# EAGLE design slider4 (EAGLE 6.5.0)
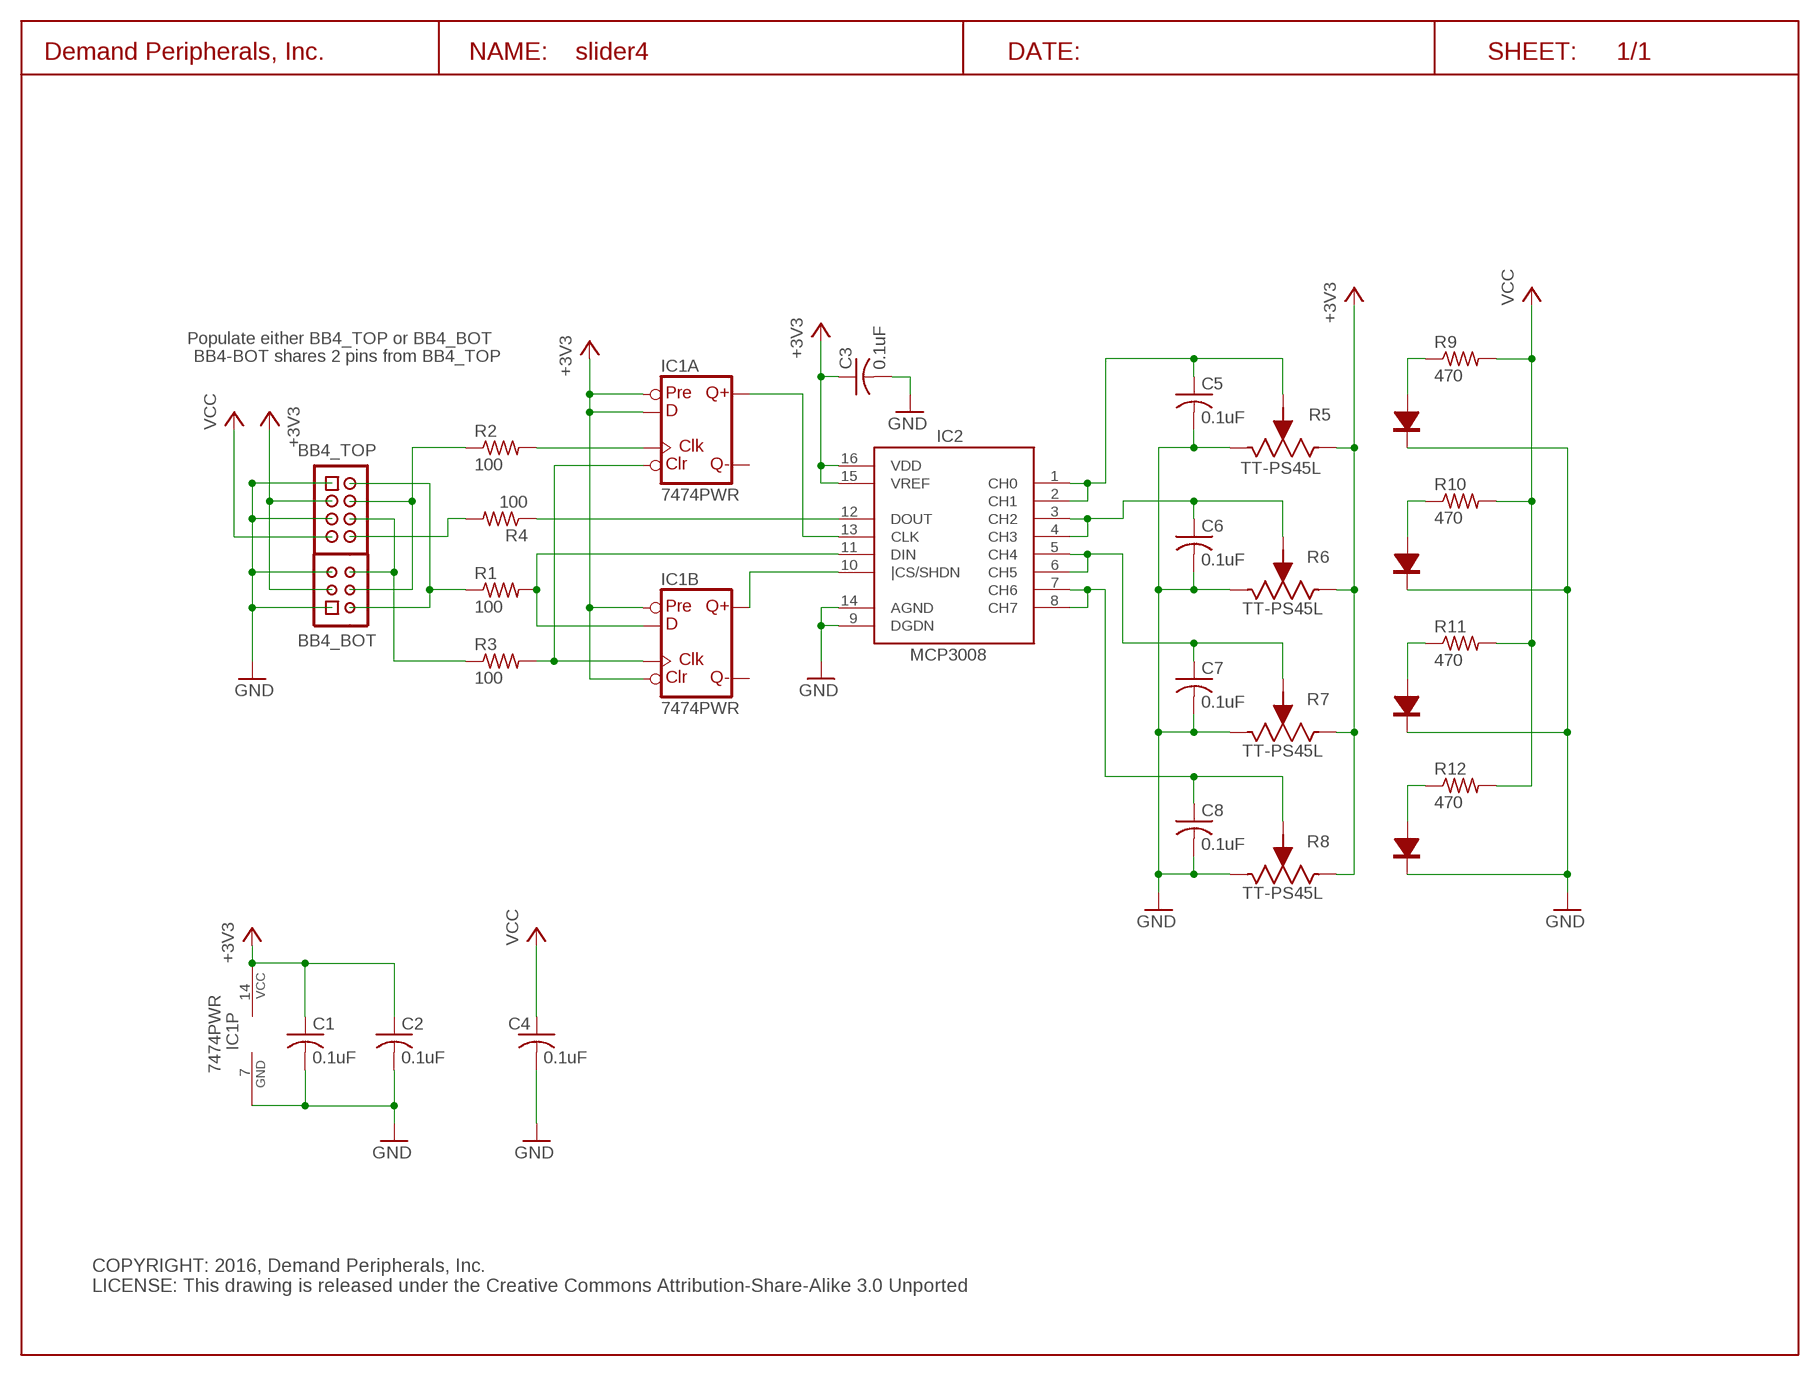
[diagram p0: schematic, sheet 1]

## Parts
BB4_BOT  Hdr3x2  HDR-3X2  [HDR-3X2]
BB4_TOP  Hdr4x2  HDR-4X2-SHR  [HDR-4X2]
C1  0.1uF  C0.1UF_C0603  [C0603]
C2  0.1uF  C0.1UF_C0603  [C0603]
C3  0.1uF  C0.1UF_C0603  [C0603]
C4  0.1uF  C0.1UF_C0603  [C0603]
C5  0.1uF  C0.1UF_C0603  [C0603]
C6  0.1uF  C0.1UF_C0603  [C0603]
C7  0.1uF  C0.1UF_C0603  [C0603]
C8  0.1uF  C0.1UF_C0603  [C0603]
IC1  7474PWR  74AHC74  [SO14]
IC2  MCP3008  [SO16]
R1  100  R100_R0603  [R0603]
R2  100  R100_R0603  [R0603]
R3  100  R100_R0603  [R0603]
R4  100  R100_R0603  [R0603]
R5  TT-PS45L  [TT-PS45L]
R6  TT-PS45L  [TT-PS45L]
R7  TT-PS45L  [TT-PS45L]
R8  TT-PS45L  [TT-PS45L]
R9  470  R470_R0603  [R0603]
R10  470  R470_R0603  [R0603]
R11  470  R470_R0603  [R0603]
R12  470  R470_R0603  [R0603]
U$7  DP_FRAME_L  [LETTER_L]

## Nets
+3V3: BB4_BOT.3 BB4_TOP.3 C1.1 C2.1 C3.1 IC1.2(A:D) IC1.4(A:PRE) IC1.10(B:PRE) IC1.13(B:CLR) IC1.14(P:VCC) IC2.15(VREF) IC2.16(VDD) R5.P$2 R6.P$2 R7.P$2 R8.P$2
GND: BB4_BOT.1 BB4_BOT.5 BB4_TOP.1 BB4_TOP.5 C1.2 C2.2 C3.2 C4.2 C5.2 C6.2 C7.2 C8.2 IC1.7(P:GND) IC2.9(DGDN) IC2.14(AGND) R5.P$4 R5.P$6 R6.P$4 R6.P$6 R7.P$4 R7.P$6 R8.P$4 R8.P$6
N$1: BB4_BOT.2 BB4_TOP.2 R1.1
N$2: IC1.9(B:Q) IC2.10(|CS/SHDN)
N$3: IC1.5(A:Q) IC2.13(CLK)
N$4: IC2.12(DOUT) R4.1
N$6: BB4_BOT.4 BB4_TOP.4 R2.1
N$7: R5.P$5 R9.1
N$8: R6.P$5 R10.1
N$9: R7.P$5 R11.1
N$10: R8.P$5 R12.1
N$11: BB4_BOT.6 BB4_TOP.6 R3.1
N$12: C5.1 IC2.1(CH0) IC2.2(CH1) R5.P$1
N$13: C6.1 IC2.3(CH2) IC2.4(CH3) R6.P$1
N$14: C7.1 IC2.5(CH4) IC2.6(CH5) R7.P$1
N$15: BB4_TOP.8 R4.2
N$17: C8.1 IC2.7(CH6) IC2.8(CH7) R8.P$1
N$34: IC1.3(A:CLK) R2.2
N$35: IC1.12(B:D) IC2.11(DIN) R1.2
N$36: IC1.1(A:CLR) IC1.11(B:CLK) R3.2
VCC: BB4_TOP.7 C4.1 R9.2 R10.2 R11.2 R12.2
Unconnected: IC1.6(A:!Q) IC1.8(B:!Q)

## Notes on the sheet
- Populate either BB4_TOP or BB4_BOT
- BB4-BOT shares 2 pins from BB4_TOP
- COPYRIGHT: 2016, Demand Peripherals, Inc.
  LICENSE: This drawing is released under the Creative Commons Attribution-Share-Alike 3.0 Unported

## Library data of the parts
BB4_BOT = dpi-conn:HDR-3X2: Unshrouded 3x2 header with 0.1 inch pitch; VENDOR: Digikey; VENDOR-PART-NUM: 952-2120-ND
BB4_TOP = dpi-conn:HDR-4X2-SHR: Shrouded 4x2 pin header; VENDOR: Digikey; VENDOR-PART-NUM: 609-3530-ND
C1-C8 = dpi-passive:C0.1UF_: 0.1 uF Capacitor, 25V, X7R; VENDOR: Digikey; VENDOR-PART-NUM: 1276-1126-2-ND
IC1 = dpi-transic:74AHC74: Dual D type positive edge triggered FLIP FLOP, preset and clear; VENDOR: Digikey; VENDOR-PART-NUM: 568-4458-1-ND
IC2 = dpi-transic:MCP3008: 8 channel ADC converter with SPI interface; VENDOR: Digikey; VENDOR-PART-NUM: MCP3008T-I/SLCT-ND
R1-R4 = dpi-passive:R100_: 100 Ohm resistor, 1%, 0.1 watt; VENDOR: Digikey; VENDOR-PART-NUM: 311-100HRTR-ND
R5-R8 = dpi-swsens:TT-PS45L: Slide pot; VENDOR: Digikey; VENDOR-PART-NUM: 987-1404-ND
R9-R12 = dpi-passive:R470_: 470 Ohm resistor, 1%, 0.1 watt; VENDOR: Digikey; VENDOR-PART-NUM: 311-470HRTR-ND
U$7 = DP:DP_FRAME_L: Landscape/Letter Document Frame

## Board
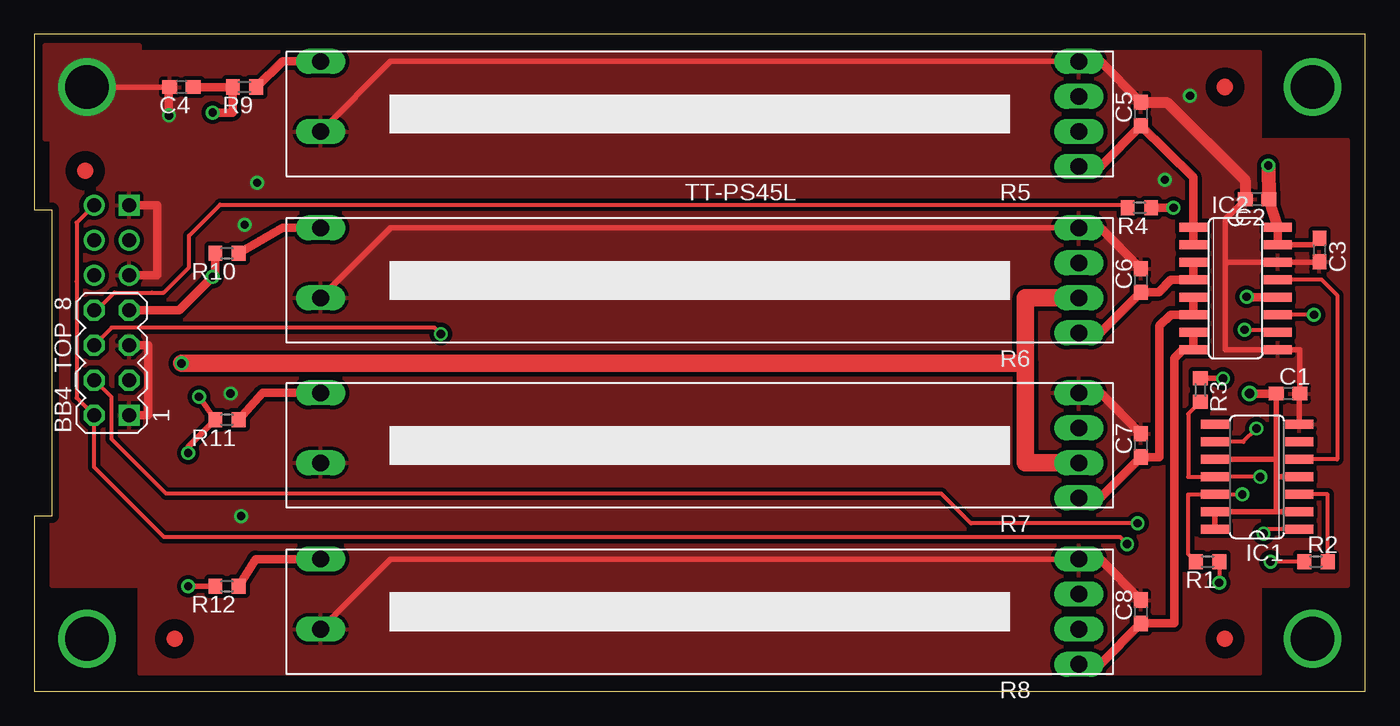
[diagram p1: board, top side]
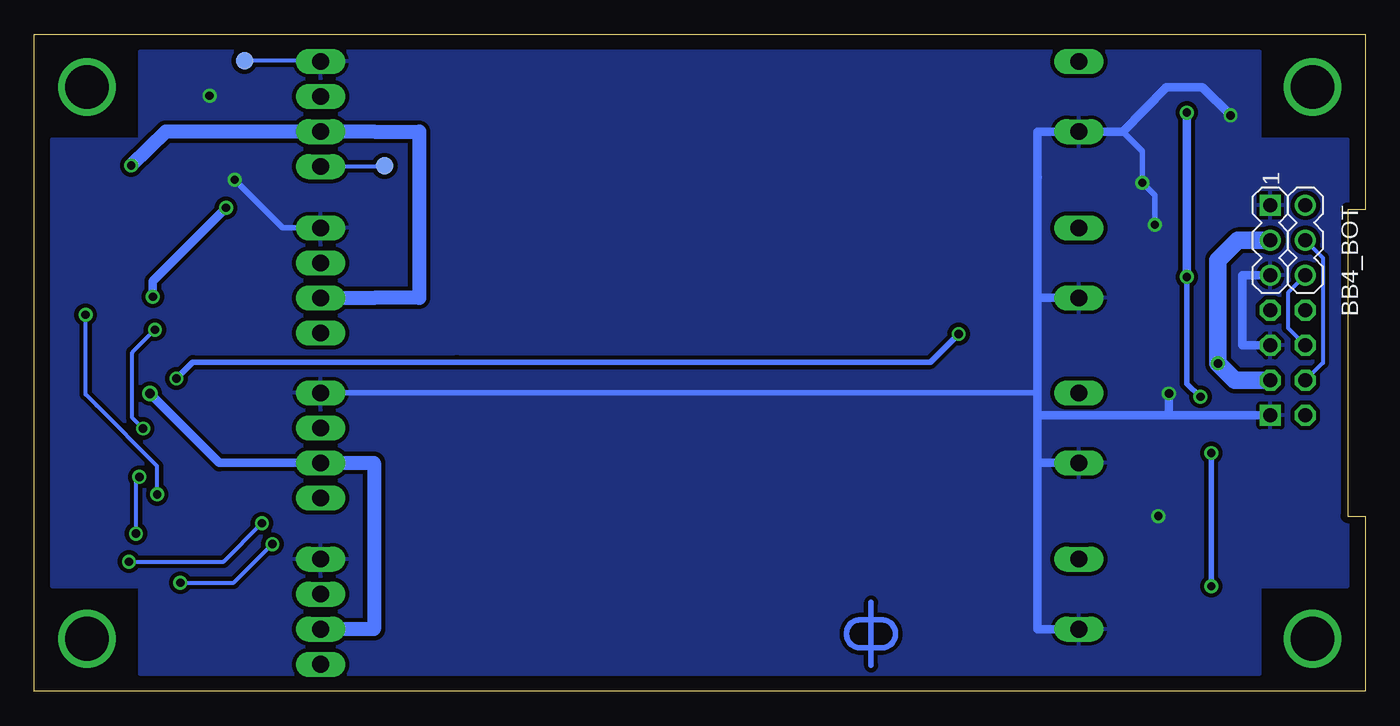
[diagram p2: board, bottom side, seen from below]

Size 96.52 x 47.62 mm. Coordinates in mm from the lower left corner, seen from the top.
Outline: 0,0 96.52,0 96.52,47.62 0,47.62 0,34.92 1.27,34.92 1.27,12.7 0,12.7 0,0
Copper layers (1*16): Top 0.035mm / dielectric 1.5mm / Bottom 0.035mm
Design rules "default *": minimum track width 10mil, minimum drill 20mil, track to track 12mil, track to pad 12mil, pad to pad 12mil, via to via 12mil, smd to smd 12mil, copper to edge 20mil, drill to drill 12mil, minimum pad ring 10mil, minimum via ring 8mil, stop-mask expansion 4mil, vias tented up to drill 0mil, thermal gap 10mil
tKeepout: area -2.5,-2.5 to -2.4,-2.4

### Footprints (pad centres in the part's own frame; a part is rotated, then mirrored left to right if it is on the bottom)
HDR-3X2 = drill 1.016 square: 1 -2.54,-1.27 | drill 1.016: 2 -2.54,1.27; 3 0,-1.27; 4 0,1.27; 5 2.54,-1.27; 6 2.54,1.27
HDR-4X2 = drill 1.016 square: 1 -3.81,-1.27 | drill 1.016 octagon: 2 -3.81,1.27; 3 -1.27,-1.27; 4 -1.27,1.27; 5 1.27,-1.27; 6 1.27,1.27; 7 3.81,-1.27; 8 3.81,1.27
C0603 = smd 1.1 x 1: 1 -0.85,0; 2 0.85,0
TEST-POINT = smd 1.27 x 1.27: P1 0,0
SO14 = smd 0.66 x 2.032: 1 -3.81,-3.073; 2 -2.54,-3.073; 3 -1.27,-3.073; 4 0,-3.073; 5 1.27,-3.073; 6 2.54,-3.073; 7 3.81,-3.073; 8 3.81,3.073; 9 2.54,3.073; 10 1.27,3.073; 11 0,3.073; 12 -1.27,3.073; 13 -2.54,3.073; 14 -3.81,3.073
SO16 = smd 0.66 x 2.032: 1 -4.445,-3.073; 2 -3.175,-3.073; 3 -1.905,-3.073; 4 -0.635,-3.073; 5 0.635,-3.073; 6 1.905,-3.073; 7 3.175,-3.073; 8 4.445,-3.073; 9 4.445,3.073; 10 3.175,3.073; 11 1.905,3.073; 12 0.635,3.073; 13 -0.635,3.073; 14 -1.905,3.073; 15 -3.175,3.073; 16 -4.445,3.073
R0603 = smd 1 x 1.1: 1 -0.85,0; 2 0.85,0
TT-PS45L = drill 1.2 long: P$1 -27.5,3.81; P$2 -27.5,1.27; P$3 -27.5,-1.27; P$4 -27.5,-3.81; P$5 27.5,-3.81; P$6 27.5,1.27

### Placement (x,y rotation side)
BB4_BOT  5.59,32.7 270 bottom
BB4_TOP  5.59,23.81 90 top
C1  90.93,21.59 0 top
C2  88.68,35.68 180 top
C3  93.22,32 270 top
C4  10.67,43.81 180 top
C5  80.26,41.86 90 top
C6  80.26,29.79 90 top
C7  80.26,17.83 90 top
C8  80.26,5.77 90 top
E$1  [TEST-POINT]  81.28,45.72 0 bottom
E$2  [TEST-POINT]  71.12,38.1 0 bottom
IC1  88.68,15.54 90 top
IC2  87.12,29.21 270 top
R1  85.09,9.4 180 top
R2  92.96,9.4 0 top
R3  84.58,21.84 270 top
R4  80.15,35.06 180 top
R5  48.26,41.86 180 top
R6  48.26,29.79 180 top
R7  48.26,17.83 180 top
R8  48.26,5.77 180 top
R9  15.24,43.81 180 top
R10  13.97,31.75 180 top
R11  13.97,19.68 180 top
R12  13.97,7.62 180 top
U$1  [DPI-1]  35.84,4.17 180 bottom
U$3  [FIDUCIAL]  86.36,3.81 270 top
U$4  [FIDUCIAL]  86.36,43.81 270 top
U$5  [FIDUCIAL]  10.16,3.81 0 top
U$6  [FIDUCIAL]  3.68,37.74 0 top
U$7  0,0 0 top

### Tracks (layer width: path | path; a pad name or v marks a point on that pad's centre or on a via)
+3V3  (via drill 0.6, 0.7)
  Top 0.406: IC1.4 90.08,15.54 | 90.08,15.54 90.08,16.5 | 90.08,16.5 C1.1 | IC1.2 90.37,13.01 | 90.37,13.01 90.08,13.01 90.08,15.54 | IC1.14 IC1.13 90.37,13.01 | IC1.10 90.08,16.82 90.08,16.5 | IC2.15 92.75,32.38 C3.1
  Top 0.61: IC2.16 IC2.15 | v88.14,21.59 C1.1
  Top 0.813: C2.1 IC2.16
  Top 1.016: v89.51,38.12 C2.1
  Top 1.27: v10.67,23.77 71.88,23.77 | R6.P$2 71.88,28.52 71.88,23.77 | R7.P$2 71.88,16.56 71.88,23.77
  Bottom 0.61: R7.P$2 83.11,16.56 v88.14,21.59
  Bottom 1.016: R6.P$2 71.88,28.52 68.61,28.52 68.61,29.45 68.61,40.59 71.88,40.59 R5.P$2 87,40.59 v89.51,38.12 | R8.P$2 71.88,4.5 71.88,16.56 R7.P$2
  Bottom 1.27: BB4_TOP.3 9.44,22.54 v10.67,23.77 10.67,31.25 9.22,32.7 BB4_BOT.3
GND  (via drill 0.6, 3.17 pad 3.17)
  Top 0.406: R5.P$4 25.84,45.67 R5.P$6 | R6.P$4 25.84,33.6 R6.P$6 | R8.P$4 25.84,9.58 R8.P$6 | IC1.7 91.76,21.57 C1.2 91.78,24.77 IC2.9 86.37,24.77 86.37,30.95 | v3.81,43.81 C4.2 | C3.2 93.18,31.11 IC2.14 86.54,31.11 86.37,30.95 | 86.37,30.95 86.37,33.54 86.37,34.22 C2.2
  Top 0.61: C4.2 9.75,43.75 v9.75,41.76 | C5.2 77.3,45.67 R5.P$4 | C6.2 77.3,33.6 R6.P$4 | C8.2 77.3,9.58 R8.P$4 | C7.2 77.3,21.64 R7.P$4 | BB4_BOT.1 8.9,35.24 8.9,30.23 8.9,30.16 BB4_BOT.5 | BB4_TOP.1 8.24,20 8.24,25.08 BB4_TOP.5
  Top 0.813: C5.2 82.13,42.71 87.83,37.06 C2.2
  Bottom 0.406: 23.77,21.64 R7.P$4 | v15.24,33.83 15.24,35.97 v16.15,36.88 16.15,39.17 17.58,40.59 | v81.99,37.08 78.51,33.6 R6.P$4
  Bottom 0.61: 23.77,16.56 23.77,16.51 23.77,16.46 23.77,9.55 23.77,9.53 23.77,4.5 R8.P$6 | 23.77,16.56 23.77,19.99 23.77,20 | 23.77,20 23.77,21.64 23.77,25.08 23.77,25.09 23.77,28.52 | 23.77,28.52 23.77,33.63 23.77,33.66 23.77,37.29 | 23.77,37.29 23.77,40.59 R5.P$6 17.58,40.59 14.4,43.81 11.81,43.81 v9.75,41.76 | 23.77,28.52 R6.P$6 | 23.77,20 13.87,20 | 23.77,37.29 23.75,37.26 | BB4_TOP.5 8.9,25.08 8.9,30.16 BB4_BOT.5 | BB4_TOP.1 13.72,20 13.87,20 | R7.P$6 23.77,16.56 | 13.87,20 14.22,20 v14.22,21.59
  other vias: 14.99,12.7 83.82,43.18
  pour Bottom: 1.27,7.62 1.27,40.01 7.62,40.01 7.62,46.35 88.9,46.35 88.9,40.01 95.25,40.01 95.25,7.62 88.9,7.62 88.9,1.27 7.62,1.27 7.62,7.62
  pour Top: 1.27,7.62 1.27,40.01 0.76,40.01 0.76,46.86 7.62,46.86 7.62,46.35 88.9,46.35 88.9,40.01 95.25,40.01 95.25,7.62 88.9,7.62 88.9,1.27 7.62,1.27 7.62,7.62
MOUNT0  (via drill 3.17 pad 3.17)
  other vias: 3.81,3.81
MOUNT6  (via drill 3.17 pad 3.17)
  other vias: 92.71,3.81
N$1  (via drill 0.6)
  Top 0.305: BB4_BOT.2 3.05,33.97 3.05,29.72 3.05,21.27 BB4_TOP.2 4.32,16.26 9.4,11.18 66.53,11.18 78.75,11.18 v79.26,10.67 | R1.1 v85.94,7.87
  Bottom 0.305: v85.94,7.87 82.06,7.87 v79.26,10.67
N$2  (via drill 0.6)
  Top 0.305: v87.78,26.21 90.02,26.21 IC2.10 | IC1.9 87.71,18.09 87.71,18.11 v88.65,19.05
  Bottom 0.305: v87.78,26.21 89.42,24.57 89.42,19.82 v88.65,19.05
N$3
  Top 0.305: IC2.13 93.37,29.84 94.49,28.73 94.49,16.82 IC1.5
N$4  (via drill 0.6)
  Top 0.61: IC2.12 87.96,28.57 v87.94,28.6 | v82.63,35.05 R4.1
  Bottom 0.61: v87.94,28.6 87.94,29.74 v82.63,35.05
N$5  (via drill 3.17 pad 3.17)
  other vias: 92.71,43.81
N$6  (via drill 0.6)
  Top 0.305: R2.1 v89.66,9.4 | v80.02,12.18 67.93,12.18 65.77,14.34 9.54,14.34 5.86,18.02 5.59,18.29 5.59,21.34 BB4_TOP.4
  Bottom 0.305: BB4_BOT.4 3.05,31.43 3.05,23.94 3.05,23.81 BB4_TOP.4 | v89.66,9.4 82.8,9.4 v80.02,12.18
N$7
  Top 0.61: R9.1 18,45.67 R5.P$5
N$8
  Top 0.61: R10.1 18,33.6 R6.P$5
N$9
  Top 0.61: R11.1 16.55,21.64 R7.P$5
N$10
  Top 0.61: R12.1 16.04,9.58 R8.P$5
N$11  (via drill 0.6)
  Top 0.305: v29.48,25.91 29.02,26.36 6.34,26.36 5.6,26.36 BB4_TOP.6
  Top 0.406: R3.1 84.59,22.68 v86.22,22.68
  Bottom 0.305: BB4_BOT.6 5.59,28.89 5.59,26.92 5.59,26.35 BB4_TOP.6
  Bottom 0.406: v86.22,22.68 85.04,23.86 65.89,23.86 31.52,23.86 v29.48,25.91
N$12
  Top 0.61: R5.P$1 77.3,38.05 C5.1 84.05,37.27 IC2.1 IC2.2
N$13
  Top 0.61: R6.P$1 77.3,25.98 C6.1 81.57,28.94 82.42,29.84 IC2.4 IC2.3
N$14
  Top 0.61: R7.P$1 77.3,14.02 C7.1 81.61,16.98 81.61,26.49 82.42,27.3 IC2.6 IC2.5
N$15
  Top 0.305: BB4_TOP.8 4.51,27.62 5.59,28.7 5.79,28.91 8.51,28.91 9.36,28.91 11.21,30.76 11.21,33.05 13.46,35.29 79.07,35.29 R4.2
N$17
  Top 0.61: R8.P$1 77.3,1.96 C8.1 82.68,4.92 82.68,24.16 83.29,24.77 IC2.8 IC2.7
N$34
  Top 0.305: R2.2 93.81,14.28 IC1.3
N$35  (via drill 0.6)
  Top 0.305: v92.81,27.3 IC2.11 | R1.2 83.69,9.95 83.69,13.46 83.69,14.28 IC1.12 v87.62,14.28
  Bottom 0.305: v87.62,14.28 87.62,16.33 92.01,20.73 92.81,21.53 v92.81,27.3
N$36  (via drill 0.6)
  Top 0.305: R3.2 83.69,20.11 83.69,15.54 IC1.11 v88.91,15.54 | IC1.1 89.46,11.73 v89.15,11.43
  Bottom 0.305: v89.15,11.43 89.15,15.3 v88.91,15.54
S$1
  Bottom 0.305: 77.42,45.71 80.73,45.71
S$2
  Bottom 0.305: 74.11,38.09 71.7,38.09
VCC  (via drill 0.6)
  Top 0.406: v11.94,21.35 13.09,19.68 R11.2 11.15,17.72 v11.15,17.27 | R12.2 v11.15,7.62
  Top 0.61: R10.2 13.12,30.28 v12.93,30.05 10.5,27.62 9.08,27.62 BB4_TOP.7 | v12.93,41.96 14.39,41.96 R9.2 C4.1
  Bottom 0.406: v11.94,21.35 12.93,22.31 v12.93,30.05 | v11.15,7.62 v11.15,17.27 | v11.15,17.27
  Bottom 0.61: v12.93,30.05 v12.93,41.96

### Text on the board
tTest: 3.8 Inches | 3.5 Inches | C4 | R9 | R5 | C5 | C2 | IC2 | C3 | Top BB4 | R4 | R10 | R6 | C6 | C1 | R3 | R11 | R7 | C7 | 1.575 Inches | 1.875 Inches | SLIDER4, Rev 17A | IC1 | R1 | R2 | R12 | R8 | C8 | (C) 2017, Demand Peripherals, Inc.
bTest: Bottom BB4